# Altium project R61509_discoveryF4_shield.PrjPcb
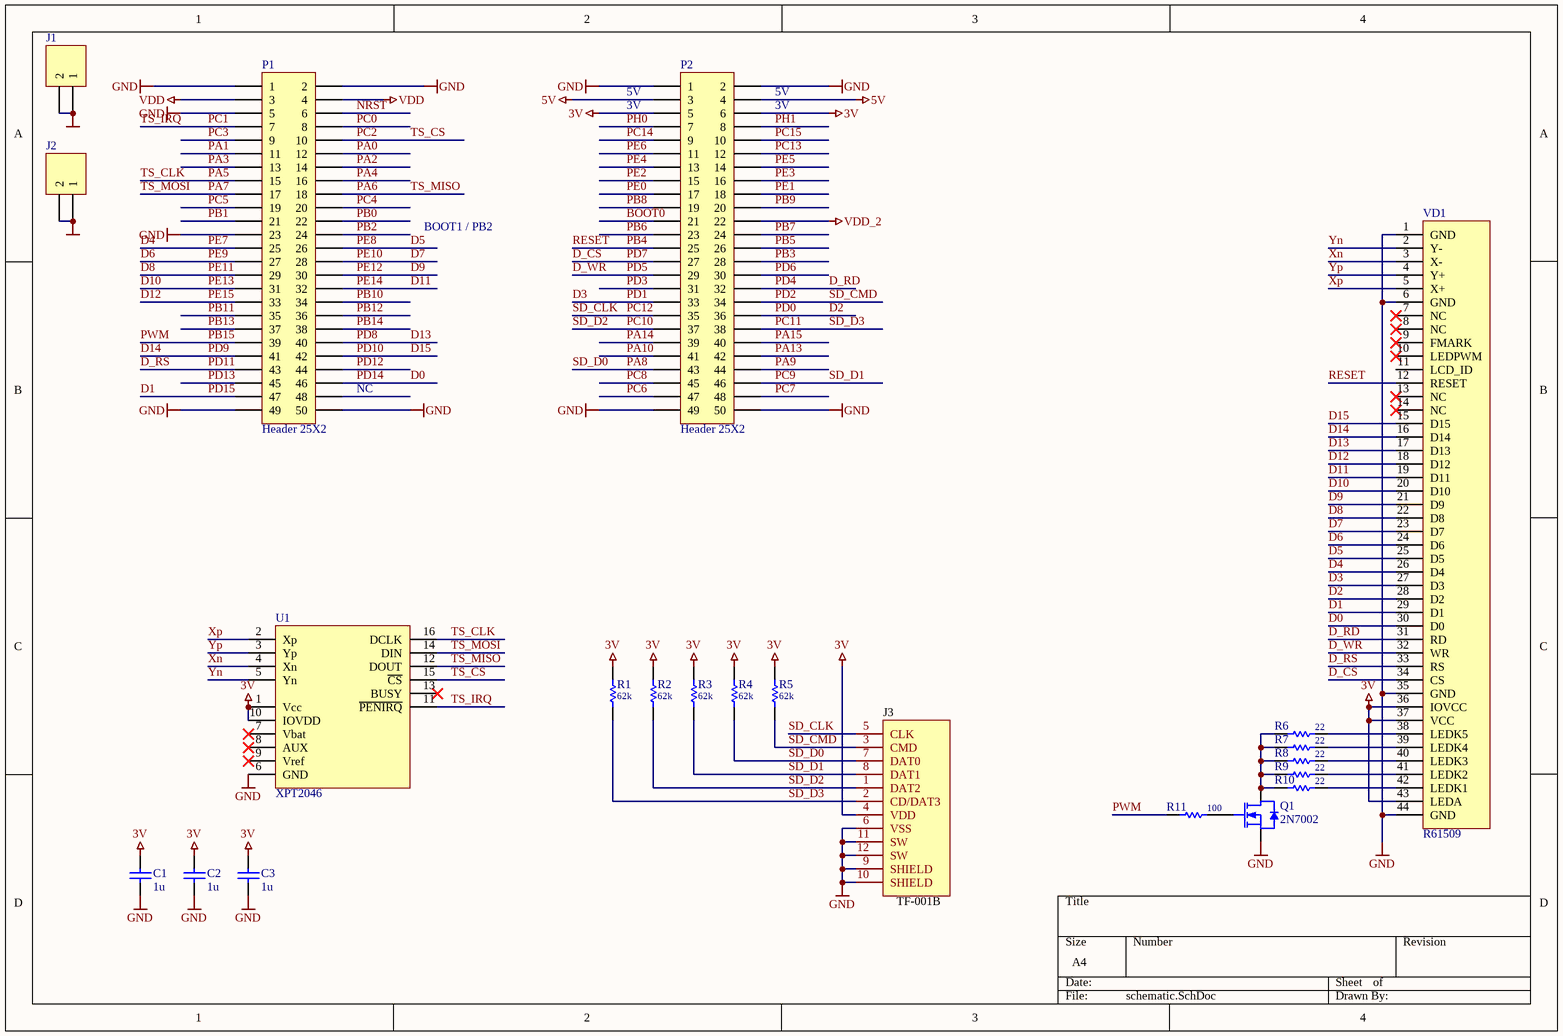
[diagram p0: schematic.SchDoc]
1 sheet, 22 parts. Net scope: global (net labels, ports and power ports of the same name join across sheets).
Board file: board.PcbDoc

## Sheet schematic.SchDoc
size A4; SheetNumber: 1; SheetTotal: 1

### Parts
C1  1u  [C0603]
C2  1u  [C0603]
C3  1u  [C0603]
J1  Header 2  [HDR_1X2]  (value not drawn)  (no BOM)
J2  Header 2  [HDR_1X2]  (value not drawn)  (no BOM)
J3  TF-001B  [TF-SMD_TF-001B]
P1  Header 25X2  [HDR_2X25]
P2  Header 25X2  [HDR_2X25]
Q1  2N7002  [SOT-23]
R1  62k  [R0805]
R2  62k  [R0805]
R3  62k  [R0805]
R4  62k  [R0805]
R5  62k  [R0805]
R6  22  [R0603]
R7  22  [R0603]
R8  22  [R0603]
R9  22  [R0603]
R10  22  [R0603]
R11  100  [R0603]
U1  XPT2046  [TSSOP-16]
VD1  R61509  [TFT_3.2inch]  (no BOM)

### Nets
3V: C1.2 C2.2 C3.2 J3.4(VDD) P2.5 P2.6 R1.1 R2.1 R3.1 R4.1 R5.1 U1.1(Vcc) U1.10(IOVDD) VD1.36(IOVCC) VD1.37(VCC) VD1.43(LEDA)
5V: P2.3 P2.4
GND: C1.1 C2.1 C3.1 J1.1 J1.2 J2.1 J2.2 J3.6(VSS) J3.9(SHIELD) J3.10(SHIELD) J3.11(SW) J3.12(SW) P1.1 P1.2 P1.5 P1.23 P1.49 P1.50 P2.1 P2.2 P2.49 P2.50 Q1.2(SOURCE) U1.6(GND) VD1.1(GND) VD1.6(GND) VD1.35(GND) VD1.44(GND)
VDD: P1.3 P1.4
VDD_2: P2.22
BOOT0: P2.21
D0: P1.46 VD1.30(D0)  [also labelled PD14]
D1: P1.47 VD1.29(D1)  [also labelled PD15]
D2: P2.36 VD1.28(D2)  [also labelled PD0]
D3: P2.33 VD1.27(D3)  [also labelled PD1]
D4: P1.25 VD1.26(D4)  [also labelled PE7]
D5: P1.26 VD1.25(D5)  [also labelled PE8]
D6: P1.27 VD1.24(D6)  [also labelled PE9]
D7: P1.28 VD1.23(D7)  [also labelled PE10]
D8: P1.29 VD1.22(D8)  [also labelled PE11]
D9: P1.30 VD1.21(D9)  [also labelled PE12]
D10: P1.31 VD1.20(D10)  [also labelled PE13]
D11: P1.32 VD1.19(D11)  [also labelled PE14]
D12: P1.33 VD1.18(D12)  [also labelled PE15]
D13: P1.40 VD1.17(D13)  [also labelled PD8]
D14: P1.41 VD1.16(D14)  [also labelled PD9]
D15: P1.42 VD1.15(D15)  [also labelled PD10]
D_CS: P2.27 VD1.34(CS)  [also labelled PD7]
D_RD: P2.32 VD1.31(RD)  [also labelled PD4]
D_RS: P1.43 VD1.33(RS)  [also labelled PD11]
D_WR: P2.29 VD1.32(WR)  [also labelled PD5]
NRST: P1.6
PA0: P1.12
PA1: P1.11
PA2: P1.14
PA3: P1.13
PA4: P1.16
PA5: P1.15 U1.16(DCLK)  [also labelled TS_CLK]
PA6: P1.18 U1.12(DOUT)  [also labelled TS_MISO]
PA7: P1.17 U1.14(DIN)  [also labelled TS_MOSI]
PA8: J3.7(DAT0) P2.43 R4.2  [also labelled SD_D0]
PA9: P2.44
PA10: P2.41
PA13: P2.42
PA14: P2.39
PA15: P2.40
PB0: P1.22
PB1: P1.21
PB2: P1.24
PB3: P2.28
PB4: P2.25 VD1.12(RESET)  [also labelled RESET]
PB5: P2.26
PB6: P2.23
PB7: P2.24
PB8: P2.19
PB9: P2.20
PB10: P1.34
PB11: P1.35
PB12: P1.36
PB13: P1.37
PB14: P1.38
PB15: P1.39 R11.1  [also labelled PWM]
PC0: P1.8
PC1: P1.7 U1.11(~{PENIRQ})  [also labelled TS_IRQ]
PC2: P1.10 U1.15(~{CS})  [also labelled TS_CS]
PC3: P1.9
PC4: P1.20
PC5: P1.19
PC6: P2.47
PC7: P2.48
PC8: P2.45
PC9: J3.8(DAT1) P2.46 R3.2  [also labelled SD_D1]
PC10: J3.1(DAT2) P2.37 R2.2  [also labelled SD_D2]
PC11: J3.2(CD/DAT3) P2.38 R1.2  [also labelled SD_D3]
PC12: J3.5(CLK) P2.35  [also labelled SD_CLK]
PC13: P2.12
PC14: P2.9
PC15: P2.10
PD2: J3.3(CMD) P2.34 R5.2  [also labelled SD_CMD]
PD3: P2.31
PD6: P2.30
PD12: P1.44
PD13: P1.45
PE0: P2.17
PE1: P2.18
PE2: P2.15
PE3: P2.16
PE4: P2.13
PE5: P2.14
PE6: P2.11
PH0: P2.7
PH1: P2.8
Xn: U1.4(Xn) VD1.3(X-)
Xp: U1.2(Xp) VD1.5(X+)
Yn: U1.5(Yn) VD1.2(Y-)
Yp: U1.3(Yp) VD1.4(Y+)
NetQ1_1: Q1.1(GATE) R11.2
NetQ1_3: Q1.3(DRAIN) R6.1 R7.1 R8.1 R9.1 R10.1
NetR6_2: R6.2 VD1.38(LEDK5)
NetR7_2: R7.2 VD1.39(LEDK4)
NetR8_2: R8.2 VD1.40(LEDK3)
NetR9_2: R9.2 VD1.41(LEDK2)
NetR10_2: R10.2 VD1.42(LEDK1)

Not connected (* = marked no-connect by the designer): P1 48; U1 7(Vbat)* 8(AUX)* 9(Vref)* 13(BUSY)*; VD1 7(NC)* 8(NC)* 9(FMARK)* 10(LEDPWM)* 11(LCD_ID) 13(NC)* 14(NC)*

### Notes on the sheet
- (near P2) 5V
- (near P2) 3V
- BOOT1 / PB2
- (near P1) NC

### Library data of the parts
C1-C3 = Cap
J3 = TF-001B: Manufacturer: SOFNG(硕方); Add into BOM: yes; Card Connection Mode: Self-bouncing; Card Type: MicroSD card (TF card); Connector Type: Card Slot; Additional Card Detection Pins: 带检测功能; Symbol: TF-001B; Device: TF-001B; LCSC Part Name: 自弹式 MicroSD卡(TF卡) 卡座; Supplier Part: C125617; Manufacturer Part: TF-001B; Supplier Footprint: SMD; JLCPCB Part Class: Extended Part; Datasheet: https://atta.szlcsc.com/upload/public/pdf/source/20200911/C125617_63CFE4E7470796235D874E54AE54675D.pdf; Supplier: LCSC; Convert to PCB: yes; Height Above Board: 1.85mm; Operating Temperature: -35℃~+85℃
P1 P2 = Header 25X2: Header, 25-Pin, Dual row; LatestRevisionDate: 17-Jul-2002; LatestRevisionNote: Re-released for DXP Platform.; Publisher: Altium Limited
R1-R11 = RES_0402_1K5-1%
U1 = U?
VD1 = R61509_TFT